# EasyEDA Pro project ProPrj_BAP PCB Bed_Bath_2025-11-06.epro

# Schematic BAP PCB Bed/Bath
Board Name: BAP PCB std; Create Date: 2025-11-05; Page Name: Sheet_1; Project Name: BAP PCB Bed/Bath; Schematic Name: BAP PCB Bed/Bath; Update Date: 2025-11-05; Add into BOM: yes; Company: Your Company; Convert to PCB: yes; Date: 2025-10-31; Draw By: malkk44.mf; REV: 1.0; Sheet: 1/1; spicePre: .
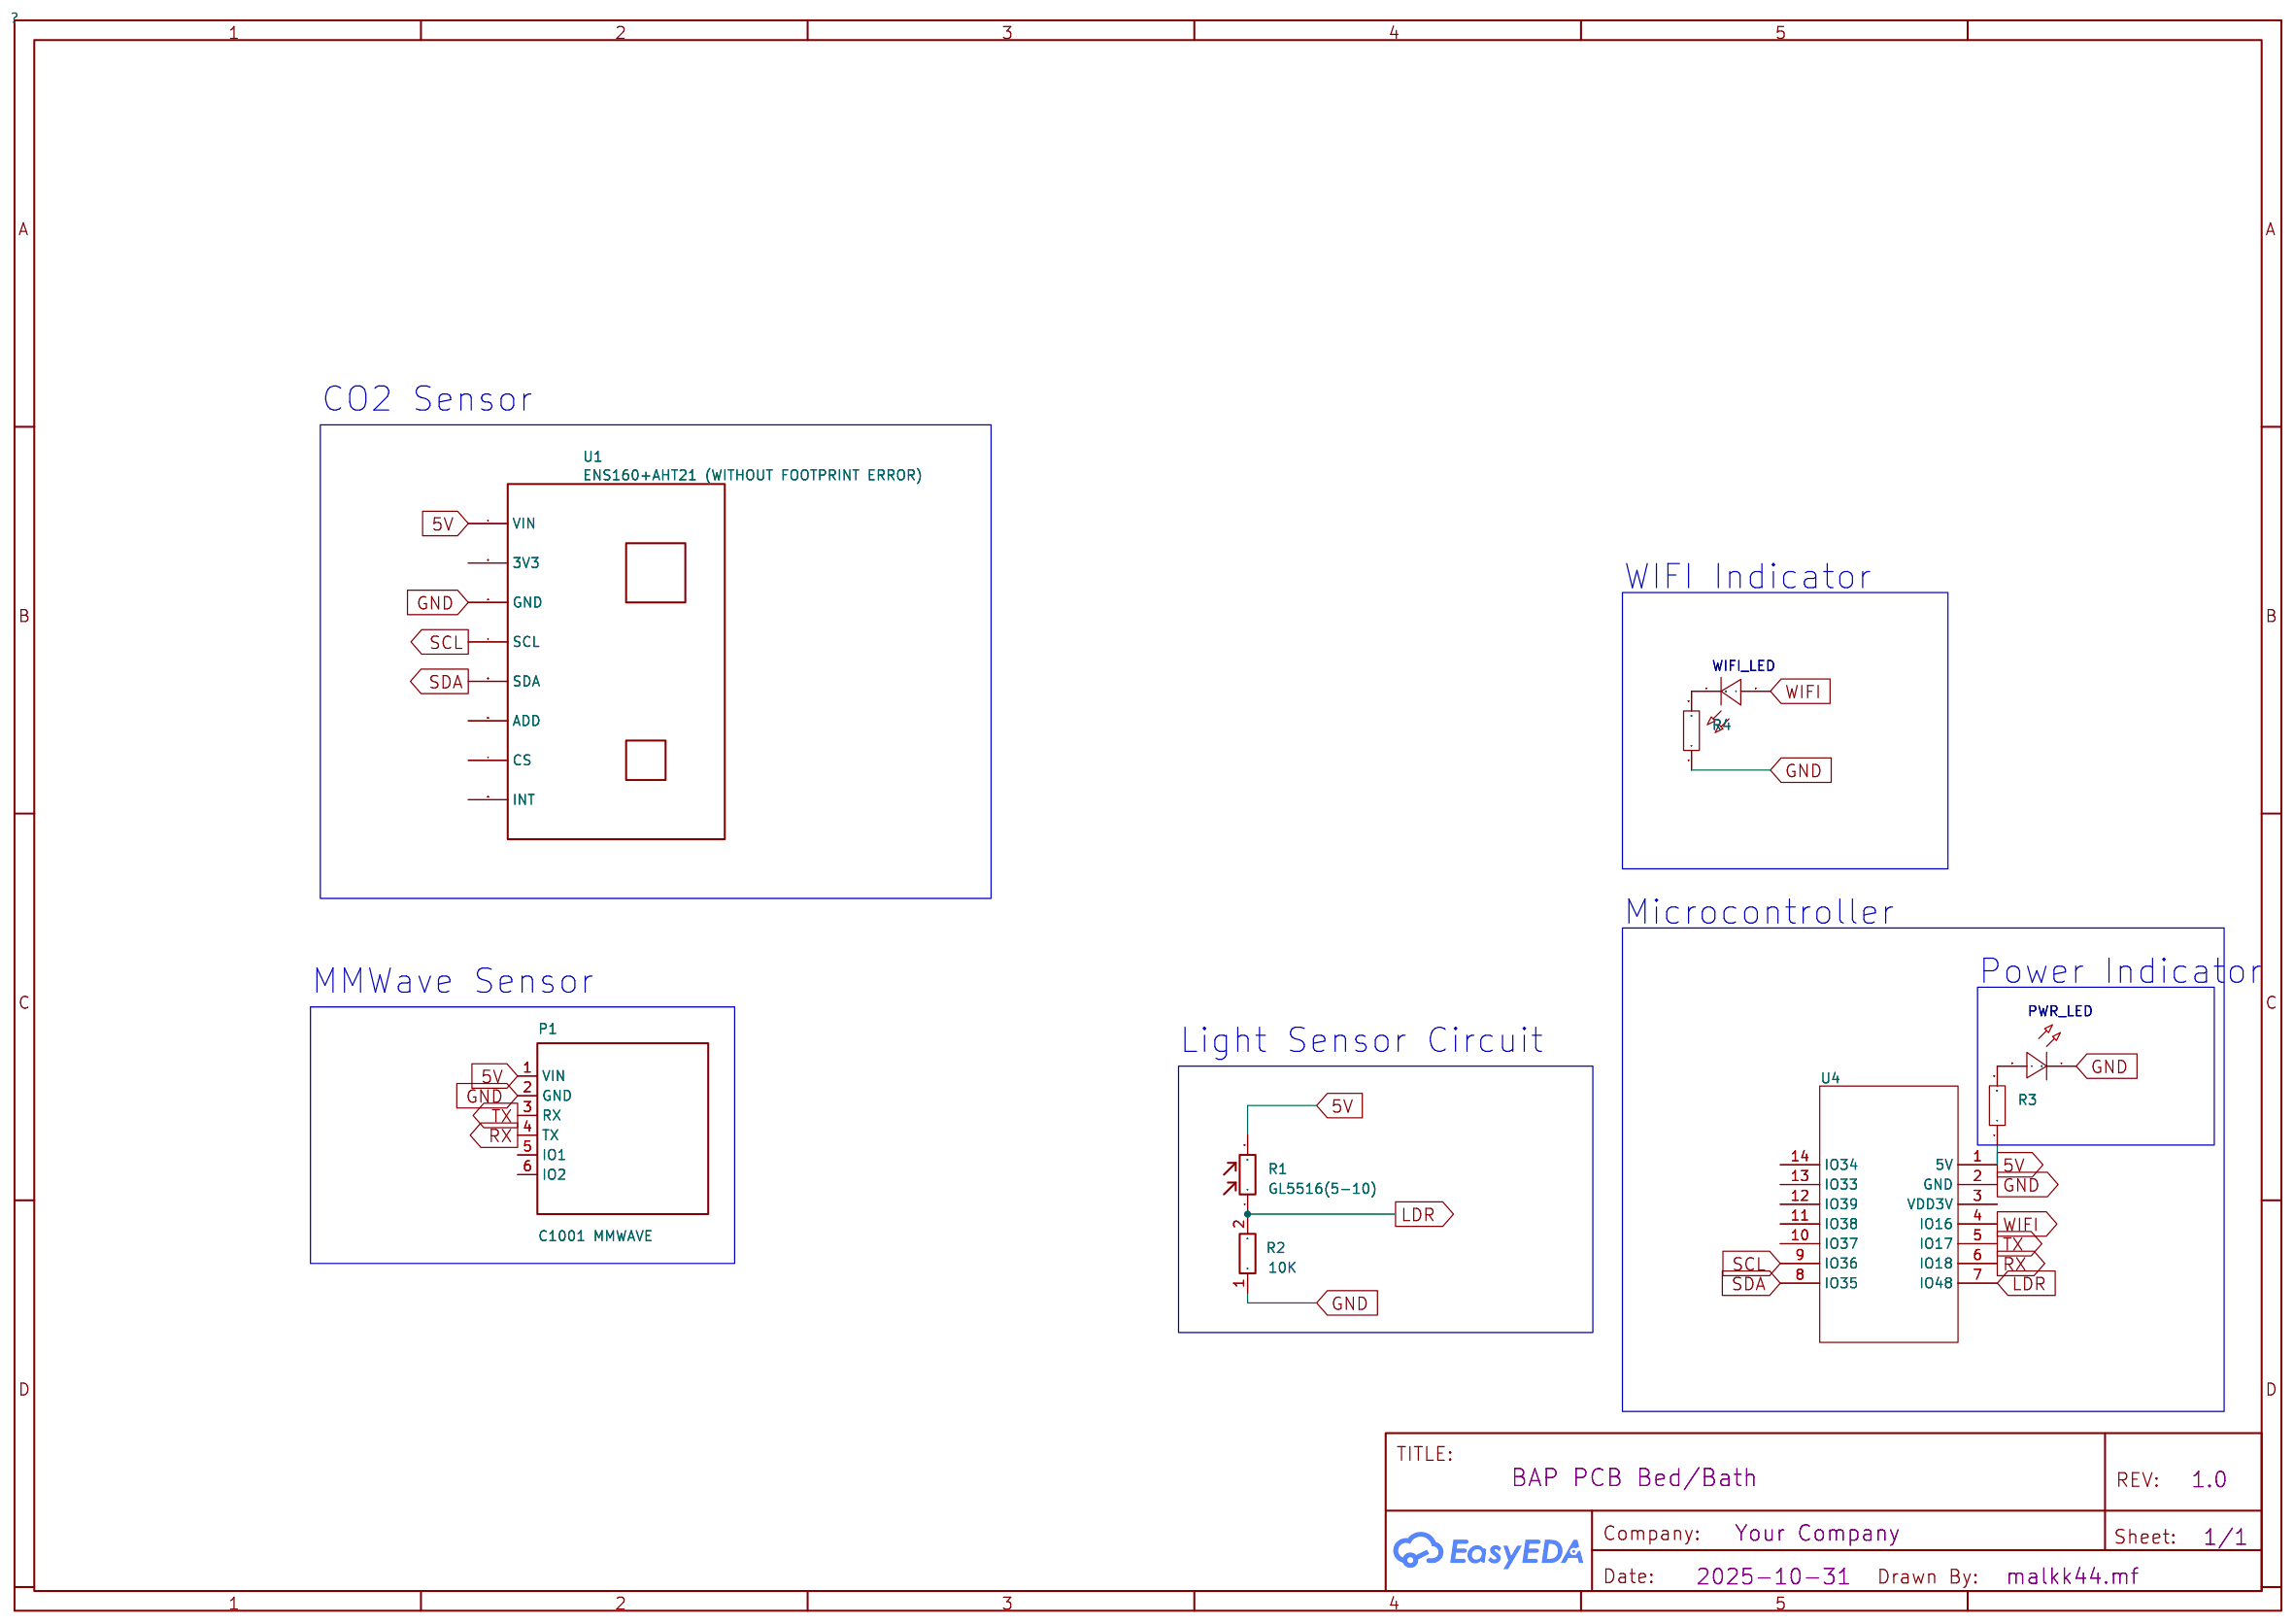
[diagram p0: schematic sheet]

## Parts
P1  C1001 MMWAVE  [DFRobot SEN0623 C1001 mmWave Human Detection Sensor]
PWR_LED  -  [LED_0603]
R1  GL5516(5-10)  [GL5516]
R2  10K  [RES_10KOHM]
R3  330Ω  [RES-TH_BD2.2-L6.5-P10.50-D0.6]
R4  330Ω  [RES-TH_BD2.2-L6.5-P10.50-D0.6]
U1  ENS160+AHT21 (WITHOUT FOOTPRINT ERROR)  [ENS160+AHT21]
U4  -  [LilyGO TQ-T Pro]
WIFI_LED  -  [LED_0603]

## Library data of the parts
P1 = C1001 MMWAVE: Supplier: LCSC; Manufacturer: BOOMELE; Manufacturer Part: Female header 1*6p; Supplier Part: C40877; JLCPCB Part Class: Extended Part
PWR_LED WIFI_LED = LED_0603-G: Supplier Footprint: 0603
R1 = GL5516(5-10): Supplier: LCSC; Manufacturer: JCHL(晶创和立); Supplier Part: C10077; JLCPCB Part Class: Extended Part; spicePre: R
R2 = 10K: Supplier: LCSC; Supplier Part: C119313; Manufacturer: CCO(千志电子); Manufacturer Part: MF1/4W-330Ω±1% T; JLCPCB Part Class: Extended Part; nameAlias: Value; Contributor: LCSC; spicePre: R; spiceSymbolName: 10K-R-THT
R3 R4 = MFR-25FTE52-330R: Type:Metal Film Resistors Resistance: Tolerance:±1% Tolerance:±1% Power(Watts):250mW Temperature Coefficient:±50ppm/℃ Temperature Coefficient:±50ppm/℃; LCSC Part Name: 330Ω ±1% 250mW; Supplier Part: C138208; Manufacturer: YAGEO(国巨); Supplier Footprint: 轴向引线; JLCPCB Part Class: Extended Part; Datasheet: https://atta.szlcsc.com/upload/public/pdf/source/20171107/C138208_15100517551321097101.pdf; Supplier: LCSC; Type: Metal Film Resistors; Tolerance: ±1%; Power(Watts): 250mW; Temperature Coefficient: ±50ppm/℃
U1 = ENS160+AHT21 (WITHOUT FOOTPRINT ERROR): Manufacturer Part: ENS160-AHT21 Air sensor; Contributor: vkbr; spicePre: U
U4 = LilyGO TQ-T Pro

## Nets
5V: P1.1(VIN) R1.2 R3.1 U1.1(VIN) U4.1(5V)
GND: P1.2(GND) PWR_LED.1(C) R2.1 R4.1 U1.3(GND) U4.2(GND)
LDR: R1.1 R2.2 U4.7(IO48)
RX: P1.4(TX) U4.6(IO18)
SCL: U1.4(SCL) U4.9(IO36)
SDA: U1.5(SDA) U4.8(IO35)
TX: P1.3(RX) U4.5(IO17)
WIFI: U4.4(IO16) WIFI_LED.2(A)
$1N1519: PWR_LED.2(A) R3.2
$1N2330: R4.2 WIFI_LED.1(C)

Not connected (* = marked no-connect by the designer): P1 5(IO1) 6(IO2); U1 2(3V3) 6(ADD) 7(CS) 8(INT); U4 3(VDD3V) 10(IO37) 11(IO38) 12(IO39) 13(IO33) 14(IO34)

## Notes on the sheet
- CO2 Sensor
- WIFI Indicator
- Microcontroller
- Power Indicator
- MMWave Sensor
- Light Sensor Circuit

# Board PCB Bed/Bath
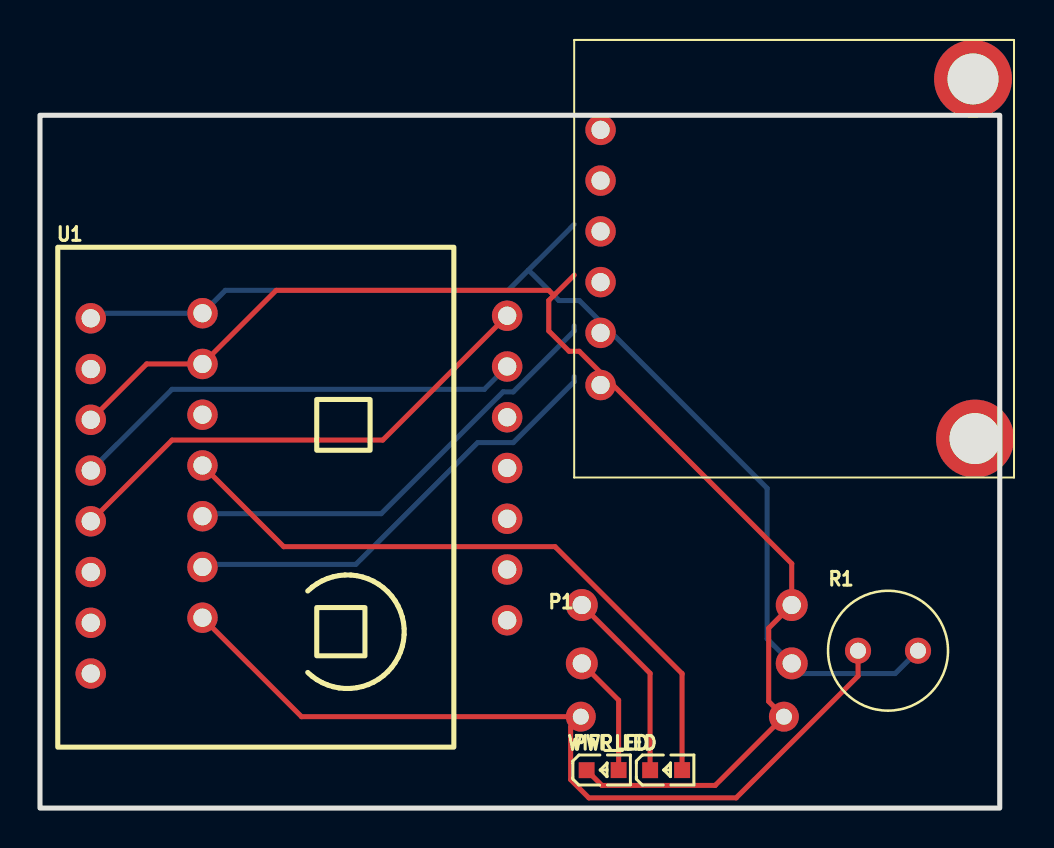
[diagram p1: board, top side]
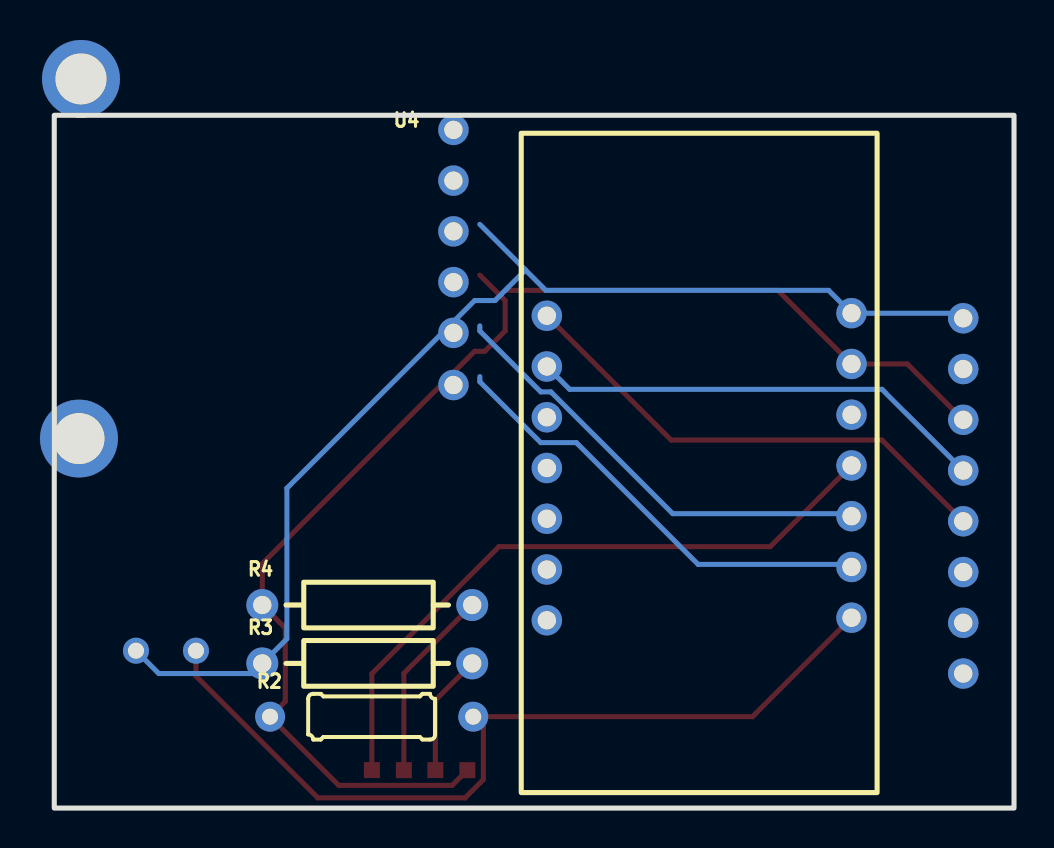
[diagram p2: board, bottom side, seen from below]

Outline 48.01 x 34.67 mm; copper layers: Top Layer, Bottom Layer. Coordinates in mm from the lower left corner of the outline.
Outline path: rectangle 0,34.67 48.01,0
Stack: Top Layer 0.035mm / Dielectric1 1.51mm FR4 er 4.5 / Bottom Layer 0.035mm

## Design rules (mm)
template: JLCPCB Capability(Two Layers Board)
spacing copperThickness1oz (default): track to track 0.102, other pairs 0.152 to 0.3
spacing copperThickness2oz: track to track 0.203, other pairs 0.152 to 0.3
track width copperThickness1oz (default): min 0.127, default 0.254, max 2.54
track width copperThickness2oz: min 0.203, default 0.254, max 2.54
differential pair differentialPair (default): width min 0.127, default 0.254, max 2.54; gap min 0.152, default 0.152
via viaSize (default): diameter min 0.5, default 0.61, max 10; hole min 0.3, default 0.305, max 6.3

## Placement (name value [footprint] x y rotation side)
P1  C1001 MMWAVE  [DFRobot SEN0623 C1001 mmWave Human Detection Sensor]  25.4 11.81 0 top
PWR_LED  -  [LED_0603]  28.19 1.91 0 top
R1  GL5516(5-10)  [GL5516]  42.42 7.87 0 top
R2  10K  [RES_10KOHM]  32.13 4.57 180 bottom
R3  330Ω  [RES-TH_BD2.2-L6.5-P10.50-D0.6]  32.35 7.24 180 bottom
R4  330Ω  [RES-TH_BD2.2-L6.5-P10.50-D0.6]  32.35 10.16 180 bottom
U1  ENS160+AHT21 (WITHOUT FOOTPRINT ERROR)  [ENS160+AHT21]  11.3 7.62 0 top
U4  -  [LilyGO TQ-T Pro]  15.75 17.27 180 bottom
WIFI_LED  -  [LED_0603]  31.37 1.91 0 top

## Footprints (pads in the part's own frame, mm; a bottom-side part is the same pattern mirrored in y, then rotated)
DFRobot SEN0623 C1001 mmWave Human Detection Sensor
  round 3.9 hole 2.55: (21.27,24.68) (21.37,6.68)
  round 1.524 hole 0.914: 1(2.64,22.13) 2(2.64,19.59) 3(2.64,17.05) 4(2.64,14.51) 5(2.64,11.97) 6(2.64,9.36)
ENS160+AHT21
  round 1.524 hole 0.914: 1(-8.763,16.891) 2(-8.763,14.351) 3(-8.763,11.811) 4(-8.763,9.271) 5(-8.763,6.731) 6(-8.763,4.191) 7(-8.763,1.651) 8(-8.763,-0.889)
GL5516
  round 1.308 hole 0.8: 1(-1.5,0) 2(1.5,0)
LED_0603
  rect 0.8x0.8 smd: 1(-0.851,-0.01) 2(0.75,-0.005)
LilyGO TQ-T Pro
  round 1.524 hole 0.914: 1(7.62,7.493) 2(7.62,4.953) 3(7.62,2.413) 4(7.62,-0.127) 5(7.62,-2.667) 6(7.62,-5.207) 7(7.62,-7.747) 8(-7.62,7.366) 9(-7.62,4.826) 10(-7.62,2.286) 11(-7.62,-0.254) 12(-7.62,-2.794) 13(-7.62,-5.334) 14(-7.62,-7.874)
RES-TH_BD2.2-L6.5-P10.50-D0.6
  round 1.6 hole 0.914: 1(-5.25,0) 2(5.25,0)
RES_10KOHM
  round 1.5 hole 0.8: 1(-5.08,0) 2(5.08,0)

## Nets
As in the schematic.

Pads without a net: P1 5 6; U1 2 6 7 8; U4 3 10 11 12 13 14

## Routing (per net, layer and track width the routed paths; a pad name or vN(x,y) marks a point on that pad's centre or on a via; arc(x,y) is an arc through that point)
5V: length 58.9
  Bottom Layer w0.254: 26.72,29.21 24.43,26.93 ; 24.43,26.93 23.42,25.91 9.27,25.91 U4.1 2.79,24.77 U1.1 ; 24.43,26.93 25.96,25.4 26.97,25.4 36.37,16 36.37,8.47 R3.1 38.11,6.73 42.78,6.73 R1.2
GND: length 66.3
  Top Layer w0.254: PWR_LED.1 28.1,1.13 33.77,1.13 R2.1 36.45,5.33 36.45,9.01 R4.1 37.6,12.23 26.97,22.86 26.47,22.86 25.45,23.88 25.45,25.4 25.7,25.66 ; U1.3 5.33,22.23 U4.2 11.81,25.91 25.45,25.91 25.7,25.66 ; 25.7,25.66 26.72,26.67
LDR: length 42.9
  Top Layer w0.254: R1.1 40.92,6.6 34.82,0.51 27.46,0.51 26.54,1.42 26.54,4.06 R2.2 13.08,4.57 U4.7
RX: length 22.7
  Bottom Layer w0.254: U4.6 8.26,12.19 15.8,12.19 21.89,18.29 23.67,18.29 26.72,21.34 26.72,21.59
SCL: length 23
  Bottom Layer w0.254: 23.37,22.1 22.22,20.96 6.6,20.96 U1.4
SDA: length 25.1
  Top Layer w0.254: U1.5 6.6,18.42 17.15,18.42 U4.8
TX: length 22.7
  Bottom Layer w0.254: U4.5 8.26,14.73 17.07,14.73 23.16,20.83 23.67,20.83 26.72,23.88 26.72,24.13
WIFI: length 33.1
  Top Layer w0.254: WIFI_LED.2 32.12,6.73 25.76,13.08 12.19,13.08 U4.4
$1N1519: length 6.1
  Top Layer w0.254: 27.1,7.24 28.94,5.4 PWR_LED.2
$1N2330: length 9.7
  Top Layer w0.254: 27.1,10.16 30.52,6.74 WIFI_LED.1
